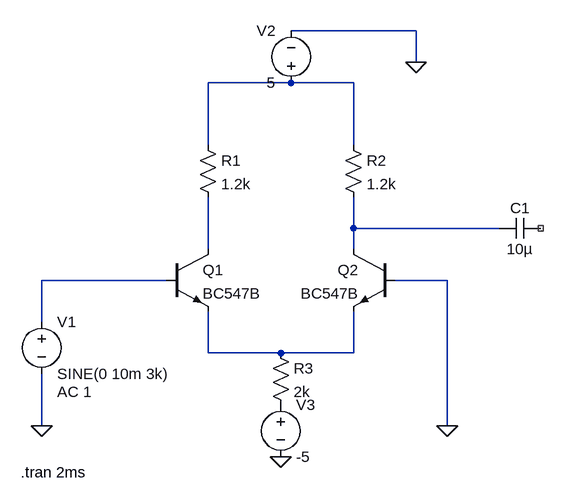
[diagram p0: schematic stage1_pre_amp.asc]
stage1_pre_amp.asc, the LTspice schematic file:
Version 4
SHEET 1 880 680
WIRE 432 -64 240 -64
WIRE 432 -16 432 -64
WIRE 240 16 112 16
WIRE 336 16 240 16
WIRE 112 112 112 16
WIRE 336 112 336 16
WIRE 336 240 336 192
WIRE 560 240 336 240
WIRE 112 272 112 192
WIRE 336 272 336 240
WIRE 48 320 -144 320
WIRE 480 320 400 320
WIRE -144 384 -144 320
WIRE 112 432 112 368
WIRE 224 432 112 432
WIRE 336 432 336 368
WIRE 336 432 224 432
WIRE -144 544 -144 464
WIRE 480 544 480 320
FLAG -144 544 0
FLAG 480 544 0
FLAG 224 592 0
FLAG 432 -16 0
SYMBOL npn 48 272 R0
SYMATTR InstName Q1
SYMATTR Value BC547B
SYMBOL npn 400 272 M0
SYMATTR InstName Q2
SYMATTR Value BC547B
SYMBOL voltage -144 368 R0
WINDOW 123 24 124 Left 2
WINDOW 39 0 0 Left 0
SYMATTR Value2 AC 1
SYMATTR InstName V1
SYMATTR Value SINE(0 10m 3k)
SYMBOL res 96 96 R0
SYMATTR InstName R1
SYMATTR Value 1.2k
SYMBOL res 320 96 R0
SYMATTR InstName R2
SYMATTR Value 1.2k
SYMBOL voltage 240 32 R180
WINDOW 0 24 96 Left 2
WINDOW 3 24 16 Left 2
WINDOW 123 0 0 Left 0
WINDOW 39 0 0 Left 0
SYMATTR InstName V2
SYMATTR Value 5
SYMBOL res 208 416 R0
SYMATTR InstName R3
SYMATTR Value 2k
SYMBOL voltage 224 496 R0
WINDOW 123 0 0 Left 0
WINDOW 39 0 0 Left 0
SYMATTR InstName V3
SYMATTR Value -5
SYMBOL cap 624 224 R90
WINDOW 0 0 32 VBottom 2
WINDOW 3 32 32 VTop 2
SYMATTR InstName C1
SYMATTR Value 10µ
TEXT -176 616 Left 2 !.tran 2ms

The netlist it stands for:
* stage1_pre_amp.asc
Q1 N003 N004 N005 0 BC547B
Q2 N002 0 N005 0 BC547B
V1 N004 0 SINE(0 10m 3k) AC 1
R1 N001 N003 1.2k
R2 N001 N002 1.2k
V2 N001 0 5
R3 N005 P001 2k
V3 P001 0 -5
C1 NC_01 N002 10µ
.model NPN NPN
.model PNP PNP
.lib standard.bjt
.tran 2ms
.backanno
.end